# Altium schematic sheet BMS_Microcontroller.SchDoc
size A
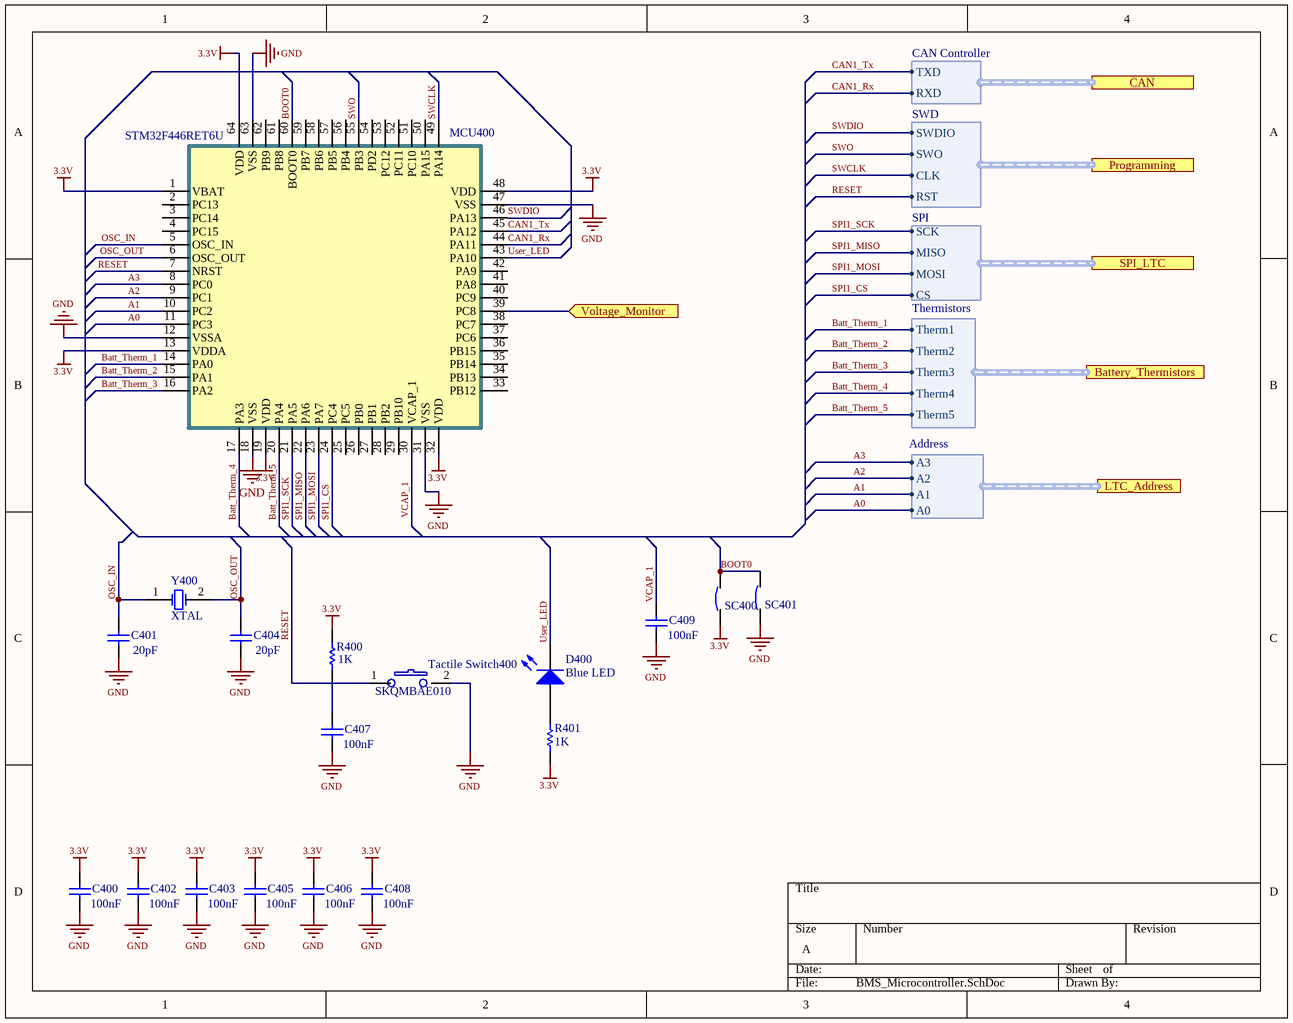
[diagram p0: BMS_Microcontroller.SchDoc]

## Parts
C400  value 100nF  [CAPC2012X14N]  (hidden comment: Cap)
C401  value 20pF  [CAPC2012X14N]  (hidden comment: Cap)
C402  value 100nF  [CAPC2012X14N]  (hidden comment: Cap)
C403  value 100nF  [CAPC2012X14N]  (hidden comment: Cap)
C404  value 20pF  [CAPC2012X14N]  (hidden comment: Cap)
C405  value 100nF  [CAPC2012X14N]  (hidden comment: Cap)
C406  value 100nF  [CAPC2012X14N]  (hidden comment: Cap)
C407  value 100nF  [CAPC2012X14N]  (hidden comment: Cap)
C408  value 100nF  [CAPC2012X14N]  (hidden comment: Cap)
C409  value 100nF  [CAPC2012X14N]  (hidden comment: Cap)
D400  Blue LED  [SMD Blue LED]
MCU400  STM32F446RET6U  [LQFP50P1200X1200X160-64N]
R400  value 1K  [RESC2012X07N]  (hidden comment: Res1)
R401  value 1K  [RESC2012X07N]  (hidden comment: Res1)
SC400  Short Circuit  [RESC2012X07N]  (value not drawn)
SC401  Short Circuit  [RESC2012X07N]  (value not drawn)
Tactile_Switch400  SKQMBAE010  [SKTHBAE010]
Y400  XTAL  [FOXSDLF/080-20]

## Ports
Battery_Thermistors (harness Thermistors), CAN (harness CAN Controller), LTC_Address (harness Address), Programming (harness SWD), SPI_LTC (harness SPI), Voltage_Monitor (in)

## Harnesses
CAN Controller: RXD, TXD
SWD: RST, CLK, SWO, SWDIO
SPI: CS, MISO, SCK, MOSI
Address: A3, A2, A1, A0
Thermistors: Therm1, Therm2, Therm4, Therm5, Therm3

## Nets
3.3V: C400.1 C402.1 C403.1 C405.1 C406.1 C408.1 MCU400.1(VBAT) MCU400.13(VDDA) MCU400.19(VDD) MCU400.32(VDD) MCU400.48(VDD) MCU400.64(VDD) R400.2 R401.2 SC400.1
GND: C400.2 C401.2 C402.2 C403.2 C404.2 C405.2 C406.2 C407.2 C408.2 C409.2 MCU400.12(VSSA) MCU400.18(VSS) MCU400.31(VSS) MCU400.47(VSS) MCU400.63(VSS) SC401.1 Tactile_Switch400.2
Batt_Therm_1: MCU400.14(PA0) ; port Battery_Thermistors.Therm1
Batt_Therm_2: MCU400.15(PA1) ; port Battery_Thermistors.Therm2
Batt_Therm_3: MCU400.16(PA2) ; port Battery_Thermistors.Therm3
Batt_Therm_4: MCU400.17(PA3) ; port Battery_Thermistors.Therm4
Batt_Therm_5: MCU400.20(PA4) ; port Battery_Thermistors.Therm5
BOOT0: MCU400.60(BOOT0) SC400.2 SC401.2
CAN1_Rx: MCU400.44(PA11) ; port CAN.RXD
CAN1_Tx: MCU400.45(PA12) ; port CAN.TXD
OSC_IN: C401.1 MCU400.5(OSC_IN) Y400.1(OSC1)
OSC_OUT: C404.1 MCU400.6(OSC_OUT) Y400.2(OSC2)
RESET: C407.1 MCU400.7(NRST) R400.1 Tactile_Switch400.1 ; port Programming.RST
SPI1_CS: MCU400.24(PC4) ; port SPI_LTC.CS
SPI1_MISO: MCU400.22(PA6) ; port SPI_LTC.MISO
SPI1_MOSI: MCU400.23(PA7) ; port SPI_LTC.MOSI
SPI1_SCK: MCU400.21(PA5) ; port SPI_LTC.SCK
SWCLK: MCU400.49(PA14) ; port Programming.CLK
SWDIO: MCU400.46(PA13) ; port Programming.SWDIO
SWO: MCU400.55(PB3) ; port Programming.SWO
User_LED: D400.2(K) MCU400.43(PA10)
VCAP_1: C409.1 MCU400.30(VCAP_1)
Voltage_Monitor: MCU400.39(PC8) ; port Voltage_Monitor
Α0: MCU400.11(PC3) ; port LTC_Address.A0
Α1: MCU400.10(PC2) ; port LTC_Address.A1
Α2: MCU400.9(PC1) ; port LTC_Address.A2
Α3: MCU400.8(PC0) ; port LTC_Address.A3
NetD400_1: D400.1(A) R401.1

Not connected (* = marked no-connect by the designer): MCU400 2(PC13) 3(PC14) 4(PC15) 25(PC5) 26(PB0) 27(PB1) 28(PB2) 29(PB10) 33(PB12) 34(PB13) 35(PB14) 36(PB15) 37(PC6) 38(PC7) 40(PC9) 41(PA8) 42(PA9) 50(PA15) 51(PC10) 52(PC11) 53(PC12) 54(PD2) 56(PB4) 57(PB5) 58(PB6) 59(PB7) 61(PB8) 62(PB9)

## Library data of the parts
C400-C409 = Cap: Capacitor; Published: 8-Jun-2000; LatestRevisionDate: 17-Jul-2002; LatestRevisionNote: Re-released for DXP Platform.; PackageReference: RAD-0.3; Publisher: Altium Limited; PackageDescription: Radial Cap, Thru-Hole; 2 Leads; 0.3 in Pin Spacing
D400 = LED0: Typical INFRARED GaAs LED; Published: 8-Jun-2000; LatestRevisionDate: 08-Jul-2005; LatestRevisionNote: Mech Layer 1 removed.; PackageReference: LED-0; Publisher: Altium Limited; PackageDescription: LED; 2 Leads
MCU400 = STM32F446RET6U: ARM® Cortex®-M4 32b MCU+FPU, 225DMIPS, up to 512kB Flash/128+4KB RAM, USB OTG HS/FS, 17 TIMs, 3 ADCs, 20 comm. interfaces
R400 R401 = Res1: Resistor; Published: 8-Jun-2000; LatestRevisionDate: 17-Jul-2002; LatestRevisionNote: Re-released for DXP Platform.; PackageReference: AXIAL-0.3; Publisher: Altium Limited; PackageDescription: Axial Device, Thru-Hole; 2 Leads; 0.3 in Pin Spacing
Tactile_Switch400 = SKQMBAE010: ALPS 6.0x3.5x4.3mm SMD Tactile Switch, Ratings 50mA/12VDC
Y400 = XTAL: Crystal Oscillator; Published: 8-Jun-2000; LatestRevisionDate: 17-Jul-2002; LatestRevisionNote: Re-released for DXP Platform.; PackageReference: R38; Publisher: Altium Limited; PackageDescription: Crystal, Thru-Hole; 2 Leads; Body 3.1 x 8.2 mm (Dia.xH)